# Altium schematic sheet CAN_Tranceiver.SchDoc
size A
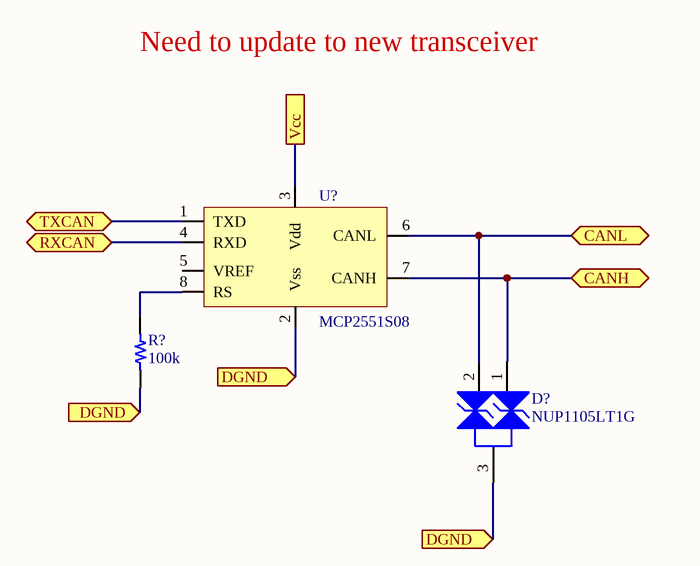
[diagram p0: CAN_Tranceiver.SchDoc]

## Parts
D?  NUP1105LT1G  [SOT-23 (TO-236)]
R?  value 100k  [RES 0805/2012]  (hidden comment: Resistor 100k 0805 1/10W 10%)
U?  MCP2551S08  [SOIC-8]

## Ports
CANH (bidir), CANL (bidir), DGND (in), RXCAN (bidir), TXCAN (bidir), Vcc

## Nets
CANH: D?.1(K) U?.7(CANH) ; port CANH
CANL: D?.2(K) U?.6(CANL) ; port CANL
DGND: D?.3(K) R?.2 U?.2(Vss) ; port DGND
RXCAN: U?.4(RXD) ; port RXCAN
TXCAN: U?.1(TXD) ; port TXCAN
Vcc: U?.3(Vdd) ; port Vcc
NetR?_1: R?.1 U?.8(RS)

Not connected (* = marked no-connect by the designer): U? 5(VREF)

## Notes on the sheet
- Need to update to new transceiver

## Library data of the parts
D? = 7: ESD Protection Diode; Manufacturer_id: 1; idDiode: 7; Name: SOT-23_350W_Zener; Value: TVS_24V; Type: Zener; Ic: 8A; Power: 350W; Drawer_id: 1; Num_Circuits: 1; Package: SOT-23; MfrPartNo: NUP1105LT1G; Link: https://www.digikey.com/product-detail/en/on-semiconductor/NUP1105LT1G/NUP1105LT1GOSCT-ND/2122067; ComponentLink1URL: https://www.digikey.com/product-detail/en/on-semiconductor/NUP1105LT1G/NUP1105LT1GOSCT-ND/2122067; Supplier1: Digikey; Supplier1PartNo: NUP1105LT1GOSCT-ND
R? = 2437: Manufacturer_id: 1; idResistor: 2437; Name: Res_100k_0805_1/10W_10%; Created_By: Nick Mah; Supplier 1: Digi-Key; Drawer_id: 1; Tolerance: 10%; Power: 1/10W; Package: 0805; ComponentLink1Description: Datasheet; Created_Date: 2018-10-20
U? = 2: Manufacturer_id: 1; idIC_Interface: 2; Name: CAN Transceiver; Value: CAN to UART; Protocol: CAN; Data_Rate: 1Mbps; Vin(Min): 4.5V; Vin(Max): 5.5V; Drawer_id: 1; Type: Transceiver; Num_Circuits: 1; Package: SOIC-8; MfrPartNo: MCP2551